# Altium schematic sheet Extras.SchDoc
size A4; SheetNumber: 4; SheetTotal: 5
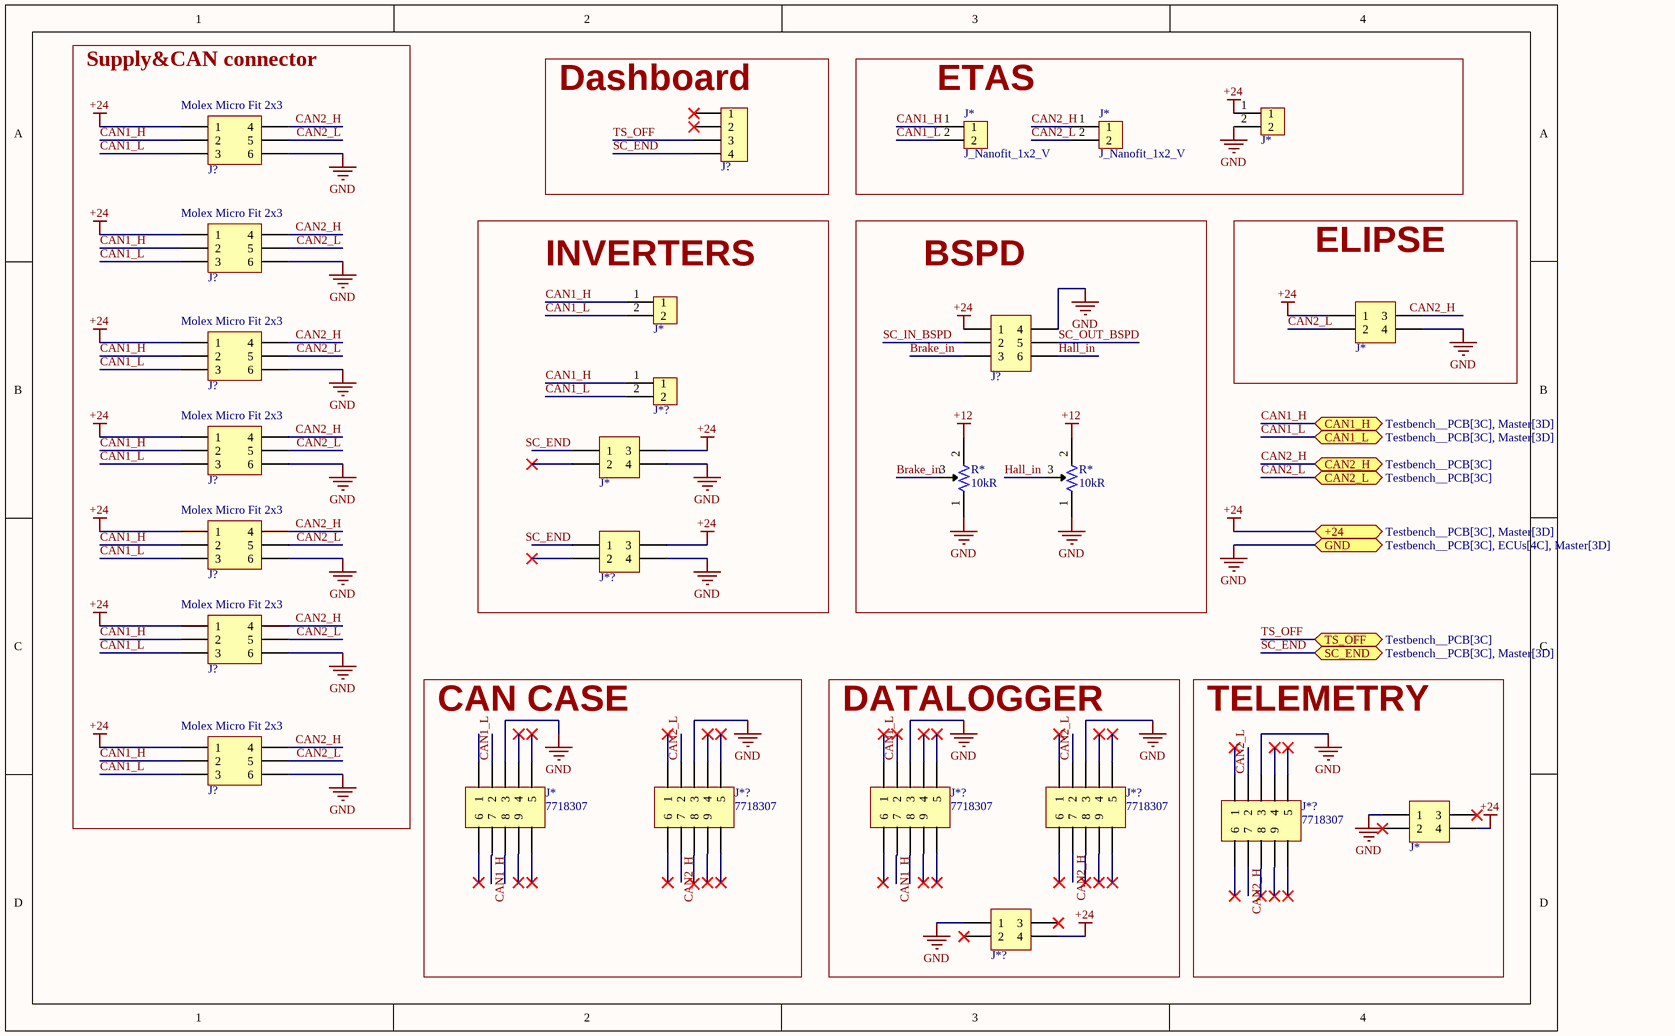
[diagram p0: Extras.SchDoc]

## Parts
(Parts that share a designator on the sheet are numbered #1, #2 ... from top to bottom, then left to right.)
J*#1  436500215  [J_MicroFit_2x1]  (value not drawn)
J*#2  J_Nanofit_1x2_V  [J_NanoFit_1X2_V]
J*#3  J_Nanofit_1x2_V  [J_NanoFit_1X2_V]
J*#4  436500215  [J_MicroFit_2x1]  (value not drawn)
J*#5  J_NanoFit_2x2  [J_NanoFit_2x2_v]  (value not drawn)
J*#6  J_NanoFit_2x2  [J_NanoFit_2x2_v]  (value not drawn)
J*#7  Supplier Part Number 1: 7718307  [J_VGA_CONNECTOR]  (hidden comment: 618009231221)
J*#8  J_NanoFit_2x2  [J_NanoFit_2x2_v]  (value not drawn)
J*?#1  436500215  [J_MicroFit_2x1]  (value not drawn)
J*?#2  J_NanoFit_2x2  [J_NanoFit_2x2_v]  (value not drawn)
J*?#3  Supplier Part Number 1: 7718307  [J_VGA_CONNECTOR]  (hidden comment: 618009231221)
J*?#4  Supplier Part Number 1: 7718307  [J_VGA_CONNECTOR]  (hidden comment: 618009231221)
J*?#5  Supplier Part Number 1: 7718307  [J_VGA_CONNECTOR]  (hidden comment: 618009231221)
J*?#6  Supplier Part Number 1: 7718307  [J_VGA_CONNECTOR]  (hidden comment: 618009231221)
J*?#7  J_NanoFit_2x2  [J_NanoFit_2x2_v]  (value not drawn)
J?#1  436500400  [J_MicroFit_1x4]  (value not drawn)
J?#2  Molex Micro Fit 2x3  [J_MicroFit_2x3_V]
J?#3  Molex Micro Fit 2x3  [J_MicroFit_2x3_V]
J?#4  J_NanoFit_2x3  [J_NanoFit_2x3]  (value not drawn)
J?#5  Molex Micro Fit 2x3  [J_MicroFit_2x3_V]
J?#6  Molex Micro Fit 2x3  [J_MicroFit_2x3_V]
J?#7  Molex Micro Fit 2x3  [J_MicroFit_2x3_V]
J?#8  Molex Micro Fit 2x3  [J_MicroFit_2x3_V]
J?#9  Molex Micro Fit 2x3  [J_MicroFit_2x3_V]
R*#1  Resistance: 10kR  [R10k-VTR]  (hidden comment: 3296W-1-103LF)
R*#2  Resistance: 10kR  [R10k-VTR]  (hidden comment: 3296W-1-103LF)

## Blocks framed on the sheet
Supply&CAN connector: J?#2 J?#3 J?#5-J?#9
Dashboard: J?#1
ETAS: J*#1-J*#3
INVERTERS: J*#4 J*#6 J*?#1 J*?#2
BSPD: J?#4 R*#1 R*#2
ELIPSE: J*#5
CAN CASE: J*#7 J*?#3
DATALOGGER: J*?#4 J*?#5 J*?#7
TELEMETRY: J*#8 J*?#6

## Ports
+24 (bidir, see Testbench__PCB[3C], Master[3D]), CAN1_H (bidir, see Testbench__PCB[3C], Master[3D]), CAN1_L (bidir, see Testbench__PCB[3C], Master[3D]), CAN2_H (bidir, see Testbench__PCB[3C]), CAN2_L (bidir, see Testbench__PCB[3C]), GND (bidir, see Testbench__PCB[3C], ECUs[4C], Master[3D]), SC_END (bidir, see Testbench__PCB[3C], Master[3D]), TS_OFF (bidir, see Testbench__PCB[3C])

## Nets
+12: R*#1.2 R*#2.2
+24: J*#1.1 J*#5.1 J*#6.3 J*#8.4 J*?#2.3 J*?#7.4 J?#2.1 J?#3.1 J?#4.1 J?#5.1 J?#6.1 J?#7.1 J?#8.1 J?#9.1 ; port +24
GND: J*#1.2 J*#5.4 J*#6.4 J*#7.3 J*#8.1 J*?#2.4 J*?#3.3 J*?#4.3 J*?#5.3 J*?#6.3 J*?#7.1 J?#2.6 J?#3.6 J?#4.4 J?#5.6 J?#6.6 J?#7.6 J?#8.6 J?#9.6 R*#1.1 R*#2.1 ; port GND
Brake_in: J?#4.3 R*#1.3
CAN1_H: J*#2.1 J*#4.1 J*#7.7 J*?#1.1 J*?#4.7 J?#2.2 J?#3.2 J?#5.2 J?#6.2 J?#7.2 J?#8.2 J?#9.2 ; port CAN1_H
CAN1_L: J*#2.2 J*#4.2 J*#7.2 J*?#1.2 J*?#4.2 J?#2.3 J?#3.3 J?#5.3 J?#6.3 J?#7.3 J?#8.3 J?#9.3 ; port CAN1_L
CAN2_H: J*#3.1 J*?#5.7 J*?#6.7 J?#2.4 J?#3.4 J?#5.4 J?#6.4 J?#7.4 J?#8.4 J?#9.4 ; port CAN2_H
CAN2_L: J*#3.2 J*#5.2 J*?#3.2 J*?#5.2 J*?#6.2 J?#2.5 J?#3.5 J?#5.5 J?#6.5 J?#7.5 J?#8.5 J?#9.5 ; port CAN2_L
Hall_in: J?#4.6 R*#2.3
SC_END: J*#6.1 J*?#2.1 J?#1.4 ; port SC_END
SC_IN_BSPD: J?#4.2
SC_OUT_BSPD: J?#4.5
TS_OFF: J?#1.3 ; port TS_OFF

Not connected (* = marked no-connect by the designer): J*#5 3; J*#6 2*; J*#7 1 4* 5* 6* 8 9* SHIELD*; J*#8 2* 3*; J*?#2 2*; J*?#3 1* 4* 5* 6* 7 8* 9* SHIELD*; J*?#4 1* 4* 5* 6* 8 9* SHIELD*; J*?#5 1* 4* 5* 6* 8* 9* SHIELD*; J*?#6 1* 4* 5* 6* 8* 9* SHIELD*; J*?#7 2* 3*; J?#1 1* 2*

## Notes on the sheet
- Labels drawn without touching a wire or pin: CAN2_H

## Library data of the parts
J*#1 J*#4 J*?#1 = J_MicroFit_2x1: Header 1 Row Vertical Polarizing Peg 2 Pin SMT/Glow Wire Compatible Tin Plate; Manufacturer 1: Molex; Manufacturer Part Number 1: 43650-0215; Supplier 1: Arrow Electronics; RoHS: Yes; Category: Headers and Wire Housings; Stock 1: 11086; Pricing 1: 1=0,87800, 10=0,74400, 80=0,63070, 3264=0,47000, 6528=0,45100, 13056=0,41760 (USD); ComponentLink1URL: https://datasheet.ciiva.com/19462/884109-19462034.pdf?src-supplier=Jameco; ComponentLink1Description: https://datasheet.ciiva.com/19462/884109-19462034.pdf?src-supplier=Jameco; ComponentLink2URL: https://datasheet.ciiva.com/5157/0436500215-pcb-headers-148687-5157608.pdf?src-supplier=Mouser; ComponentLink2Description: https://datasheet.ciiva.com/5157/0436500215-pcb-headers-148687-5157608.pdf?src-supplier=Mouser; ComponentLink3URL: https://datasheet.ciiva.com/16085/0436500215-pcb-headers-16085668.pdf?src-supplier=Onlinecomponents.com; ComponentLink3Description: https://datasheet.ciiva.com/16085/0436500215-pcb-headers-16085668.pdf?src-supplier=Onlinecomponents.com; ComponentLink4URL: https://datasheet.ciiva.com/11748/0900766b80307ce2-11748388.pdf?src-supplier=RSComponents; ComponentLink4Description: https://datasheet.ciiva.com/11748/0900766b80307ce2-11748388.pdf?src-supplier=RSComponents; ComponentLink5URL: https://datasheet.ciiva.com/9432/0436500215-pcb-headers-9432850.pdf?src-supplier=Avnet; ComponentLink5Description: https://datasheet.ciiva.com/9432/0436500215-pcb-headers-9432850.pdf?src-supplier=Avnet; ComponentLink6URL: https://datasheet.ciiva.com/7920/1889390-7920892.pdf?src-supplier=Element14; ComponentLink6Description: https://datasheet.ciiva.com/7920/1889390-7920892.pdf?src-supplier=Element14; Supplier Part Number 1: 43650-0215
J*#2 J*#3 = J_Nanofit_1x2_V: Nano-Fit Vertical Header, Through Hole, 2.50mm Pitch, Single Row, 2 Circuits, with Kinked Pins, Tin (Sn) Plating,...; Manufacturer: Molex; Manufacturer Part Number: 1053092202; Supplier 1: Mouser; RoHS: No; Stock 1: 6299; Pricing 1: 1=1,09, 10=0,839, 50=0,839, 100=0,686, 1000=0,571, 10000=0,507 (USD); Supplier Part Number 1: 538-105309-2202
J*#5 J*#6 J*#8 J*?#2 J*?#7 = J_NanoFit_2x2: Conn Nano-Fit Power HDR 4 POS 2.5mm Solder ST Through Hole 4 Terminal Single Port Tray; Manufacturer 1: Molex; Manufacturer Part Number 1: 1053101104; Supplier 1: Farnell; RoHS: Yes; Category: Uncategorized; Stock 1: 255; Pricing 1: 1=1,43000, 10=1,18000, 50=0,74900, 100=0,72900, 500=0,71400, 1000=0,70700 (EUR); ComponentLink1URL: https://www.molex.com/pdm_docs/ps/PS-105300-100-001.pdf?src-supplier=Digi-Key; ComponentLink1Description: https://www.molex.com/pdm_docs/ps/PS-105300-100-001.pdf?src-supplier=Digi-Key; Supplier Part Number 1: 2820681
J*#7 J*?#3-J*?#6 = J_VGA_CONNECTOR: 9 Way Right Angle Through Hole PCB D-sub Connector Plug; 2.77mm; 2.84mm Pitch; Manufacturer: Wurth Electronics; Gender: Male; Current Rating: 3A; Voltage Rating: 125V; Number of Contacts: 9; Supplier 1: Rs; Manufacturer Part Number: 618009231221; RoHS: Yes; Category: D-Sub Connectors; Stock 1: 136; Pricing 1: 1=2,78, 10=2,59, 50=2,45, 100=2,3 (EUR); Mounting Technology: Through Hole; Contact Material: Copper Alloy; Contact Plating: Gold; Housing Material: Steel; Min Operating Temperature: -40°C; Max Operating Temperature: 85°C; Number of Rows: 2; Termination: SMD/SMT; Orientation: Right Angle; Series: 618; Length: 30.8mm; Width: 12.5mm; Depth: 18.5mm; Pitch: 2.84mm; RoHS Compliant: Yes; Reach SVHC Compliant: Unknown; ComponentLink1URL: https://datasheet.ciiva.com/12669/6180xx231221-12669204.pdf?src-supplier=Mouser; ComponentLink1Description: https://datasheet.ciiva.com/12669/6180xx231221-12669204.pdf?src-supplier=Mouser; ComponentLink2URL: https://datasheet.ciiva.com/25605/0900766b81191766-25605476.pdf?src-supplier=Rs; ComponentLink2Description: https://datasheet.ciiva.com/25605/0900766b81191766-25605476.pdf?src-supplier=Rs; ComponentLink3URL: https://datasheet.ciiva.com/1426/1442191-1426429.pdf?src-supplier=Element14; ComponentLink3Description: https://datasheet.ciiva.com/1426/1442191-1426429.pdf?src-supplier=Element14
J?#1 = J_MicroFit_1x4: Connector Wire to Board Header 4 Position 3mm Solder Right Angle Thru-Hole Tray; Manufacturer 1: Molex; Manufacturer Part Number 1: 43650-0400; Current Rating: 5A; Voltage Rating: 600V; Contact Resistance: 10mR; Connector Type: Plug; Number of Positions: 4; Gender: Male; Voltage Rating (DC): 250V; Glow Wire Compliant: Compliant; Supplier 1: Farnell; RoHS: Yes; Category: Headers and Wire Housings; Stock 1: 4623; Pricing 1: 1=1,24000, 10=1,22000, 50=1,19000, 100=1,17000, 500=1,14000, 1000=1,12000 (EUR); Mount: Through Hole,Cable; Contact Material: Brass,Copper Alloy; Contact Plating: Tin; Color: Black; Housing Color: Black; Housing Material: Thermoplastic; Min Operating Temperature: -40°C; Max Operating Temperature: 105°C; Termination: Solder; Orientation: Right Angle; Number of Rows: 1; Packaging: Tray; Package Quantity: 2380; Number of Contacts: 4; Max Voltage Rating (AC): 600V; Number of Circuits: 4; Series: 43650; Length: 14.86mm; Height: 4.5mm; Pitch: 3mm; Depth: 3.6mm; Radiation Hardening: No; Halogen Free: Low Halogen; Lead Free: Contains Lead; Flammability Rating: UL94 V-0; RoHS Compliant: Yes; ComponentLink1URL: https://datasheet.ciiva.com/19462/884184-19462234.pdf?src-supplier=Jameco; ComponentLink1Description: https://datasheet.ciiva.com/19462/884184-19462234.pdf?src-supplier=Jameco; ComponentLink2URL: https://datasheet.ciiva.com/5151/0436500400-pcb-headers-148663-5151881.pdf?src-supplier=Mouser; ComponentLink2Description: https://datasheet.ciiva.com/5151/0436500400-pcb-headers-148663-5151881.pdf?src-supplier=Mouser; ComponentLink3URL: https://datasheet.ciiva.com/16085/0436500400-pcb-headers-16085752.pdf?src-supplier=Onlinecomponents.com; ComponentLink3Description: https://datasheet.ciiva.com/16085/0436500400-pcb-headers-16085752.pdf?src-supplier=Onlinecomponents.com; ComponentLink4URL: https://datasheet.ciiva.com/11748/0900766b80d6135b-11748178.pdf?src-supplier=RSComponents; ComponentLink4Description: https://datasheet.ciiva.com/11748/0900766b80d6135b-11748178.pdf?src-supplier=RSComponents; ComponentLink5URL: https://datasheet.ciiva.com/30221/142510436500400-pcb-headers-30221164.pdf?src-supplier=Onlinecomponents.com; ComponentLink5Description: https://datasheet.ciiva.com/30221/142510436500400-pcb-headers-30221164.pdf?src-supplier=Onlinecomponents.com; ComponentLink6URL: https://datasheet.ciiva.com/17080/70266896-17080471.pdf?src-supplier=Allied+Electronics; ComponentLink6Description: https://datasheet.ciiva.com/17080/70266896-17080471.pdf?src-supplier=Allied+Electronics; ComponentLink7URL: https://datasheet.ciiva.com/7094/1946229-7094763.pdf?src-supplier=Newark; ComponentLink7Description: https://datasheet.ciiva.com/7094/1946229-7094763.pdf?src-supplier=Newark; ComponentLink8URL: https://datasheet.ciiva.com/9449/0436500400-pcb-headers-9449446.pdf?src-supplier=Avnet; ComponentLink8Description: https://datasheet.ciiva.com/9449/0436500400-pcb-headers-9449446.pdf?src-supplier=Avnet; Supplier Part Number 1: 1012232
J?#2 J?#3 J?#5-J?#9 = J_MicroFit_2x3_V: Micro fit Header, 2 Row, Vertical, Polarizing Peg, 6 Pin, Tin Plate, SMT/Glow Wire, Kinked Leads; Manufacturer Part Number: 43045-0612; .Creator: DO; ComponentLink8Description: Where buy it; ComponentLink8URL: https://www.molex.com/molex/products/part-detail/pcb_headers/0430450612; Supplier 1: RSComponents; Manufacturer: Molex; RoHS: Yes; Category: Headers and Wire Housings; Stock 1: 2635; Pricing 1: 5=1,45500, 100=1,26700, 375=1,08900, 1500=0,90900, 3000=0,72900 (USD); ComponentLink1URL: https://www.molex.com/pdm_docs/sd/430450612_sd.pdf; ComponentLink1Description: Datasheet; ComponentLink2URL: https://datasheet.ciiva.com/11748/0900766b800bd7d2-11748707.pdf?src-supplier=RSComponents; ComponentLink2Description: https://datasheet.ciiva.com/11748/0900766b800bd7d2-11748707.pdf?src-supplier=RSComponents; ComponentLink3URL: https://datasheet.ciiva.com/19462/883464-19462371.pdf?src-supplier=Jameco; ComponentLink3Description: https://datasheet.ciiva.com/19462/883464-19462371.pdf?src-supplier=Jameco; ComponentLink4URL: https://datasheet.ciiva.com/30194/128550430450612-pcb-headers-30194512.pdf?src-supplier=Onlinecomponents.com; ComponentLink4Description: https://datasheet.ciiva.com/30194/128550430450612-pcb-headers-30194512.pdf?src-supplier=Onlinecomponents.com; ComponentLink5URL: https://datasheet.ciiva.com/9468/0430450612-pcb-headers-9468492.pdf?src-supplier=Avnet; ComponentLink5Description: https://datasheet.ciiva.com/9468/0430450612-pcb-headers-9468492.pdf?src-supplier=Avnet; Supplier Part Number 1: 2332898
R*#1 R*#2 = R10k-VTR: Trimmer, Cermet, Rest 10 Kilohms, PCB, 25 Turns, Pwr-Rtg 0.5W, 3296 Series; Manufacturer: Bourns; Tolerance: 10%; Power Rating: 500mW; Number of Turns: 25; Temperature Coefficient: 100ppm/°C; Insulation Resistance: 1GR; .Creator: DO; Supplier 1: RSComponents; Manufacturer Part Number: 3296W-1-103LF; RoHS: Yes; Category: Variable Resistors and Potentiometers; Stock 1: 3300; Pricing 1: 50=2,54800, 100=2,31900, 200=2,14000, 300=1,88400, 500=1,55300 (USD); Mount: PCB,Through Hole; Weight: 0.03oz; Color: Blue; Contact Plating: Tin,Matte; Min Operating Temperature: -55°C; Max Operating Temperature: 125°C; Packaging: Rail/Tube; Package Quantity: 50; Termination: Pin; Resistor Type: Cermet; Technology: CERMET; Taper: Linear; Max Power Dissipation: 500mW; Series: 3296; Resistance Tolerance: 10%; Length: 9.53mm; Width: 9.53mm; Height: 0.395inch; Depth: 4.83mm; Radiation Hardening: No; REACH SVHC: No SVHC; Military Standard: Not; Lead Free: Lead Free; RoHS Compliant: Yes; ComponentLink1URL: https://datasheet.ciiva.com/19454/853572-19454866.pdf?src-supplier=Jameco; ComponentLink1Description: https://datasheet.ciiva.com/19454/853572-19454866.pdf?src-supplier=Jameco; ComponentLink2URL: https://datasheet.ciiva.com/11830/0900766b8069ccf4-11830871.pdf?src-supplier=RSComponents; ComponentLink2Description: https://datasheet.ciiva.com/11830/0900766b8069ccf4-11830871.pdf?src-supplier=RSComponents; ComponentLink3URL: https://datasheet.ciiva.com/29122/447277-da-01-en-trimmer-tht3296w-1-103lf-10k-0-5w-29122362.pdf?src-supplier=Conrad; ComponentLink3Description: https://datasheet.ciiva.com/29122/447277-da-01-en-trimmer-tht3296w-1-103lf-10k-0-5w-29122362.pdf?src-supplier=Conrad; ComponentLink4URL: https://datasheet.ciiva.com/26913/3296w-1-103lf-26913885.pdf?src-supplier=IIIC; ComponentLink4Description: https://datasheet.ciiva.com/26913/3296w-1-103lf-26913885.pdf?src-supplier=IIIC; ComponentLink5URL: https://datasheet.ciiva.com/1131/1815117-1131273.pdf?src-supplier=Element14; ComponentLink5Description: https://datasheet.ciiva.com/1131/1815117-1131273.pdf?src-supplier=Element14; ComponentLink6URL: https://datasheet.ciiva.com/18411/70153578-18411561.pdf?src-supplier=Allied+Electronics; ComponentLink6Description: https://datasheet.ciiva.com/18411/70153578-18411561.pdf?src-supplier=Allied+Electronics; ComponentLink7URL: https://datasheet.ciiva.com/3266/3296-3266187.pdf?src-supplier=Avnet; ComponentLink7Description: https://datasheet.ciiva.com/3266/3296-3266187.pdf?src-supplier=Avnet; ComponentLink8URL: https://datasheet.ciiva.com/30093/3296-30093899.pdf?src-supplier=Onlinecomponents.com; ComponentLink8Description: https://datasheet.ciiva.com/30093/3296-30093899.pdf?src-supplier=Onlinecomponents.com; ComponentLink9URL: https://datasheet.ciiva.com/2156/3296-2156893.pdf?src-supplier=Digi-Key; ComponentLink9Description: https://datasheet.ciiva.com/2156/3296-2156893.pdf?src-supplier=Digi-Key; ComponentLink10URL: https://datasheet.ciiva.com/14173/ew3296-dat-e-14173022.pdf?src-supplier=Distrelec; ComponentLink10Description: https://datasheet.ciiva.com/14173/ew3296-dat-e-14173022.pdf?src-supplier=Distrelec; Supplier Part Number 1: 1673377; ComponentLink11Description: Where buy it; ComponentLink11URL: https://es.rs-online.com/web/p/potenciometros-de-ajuste/5219647